# Altium schematic sheet pagerv2.SchDoc
size A4; SheetNumber: 1; SheetTotal: 2
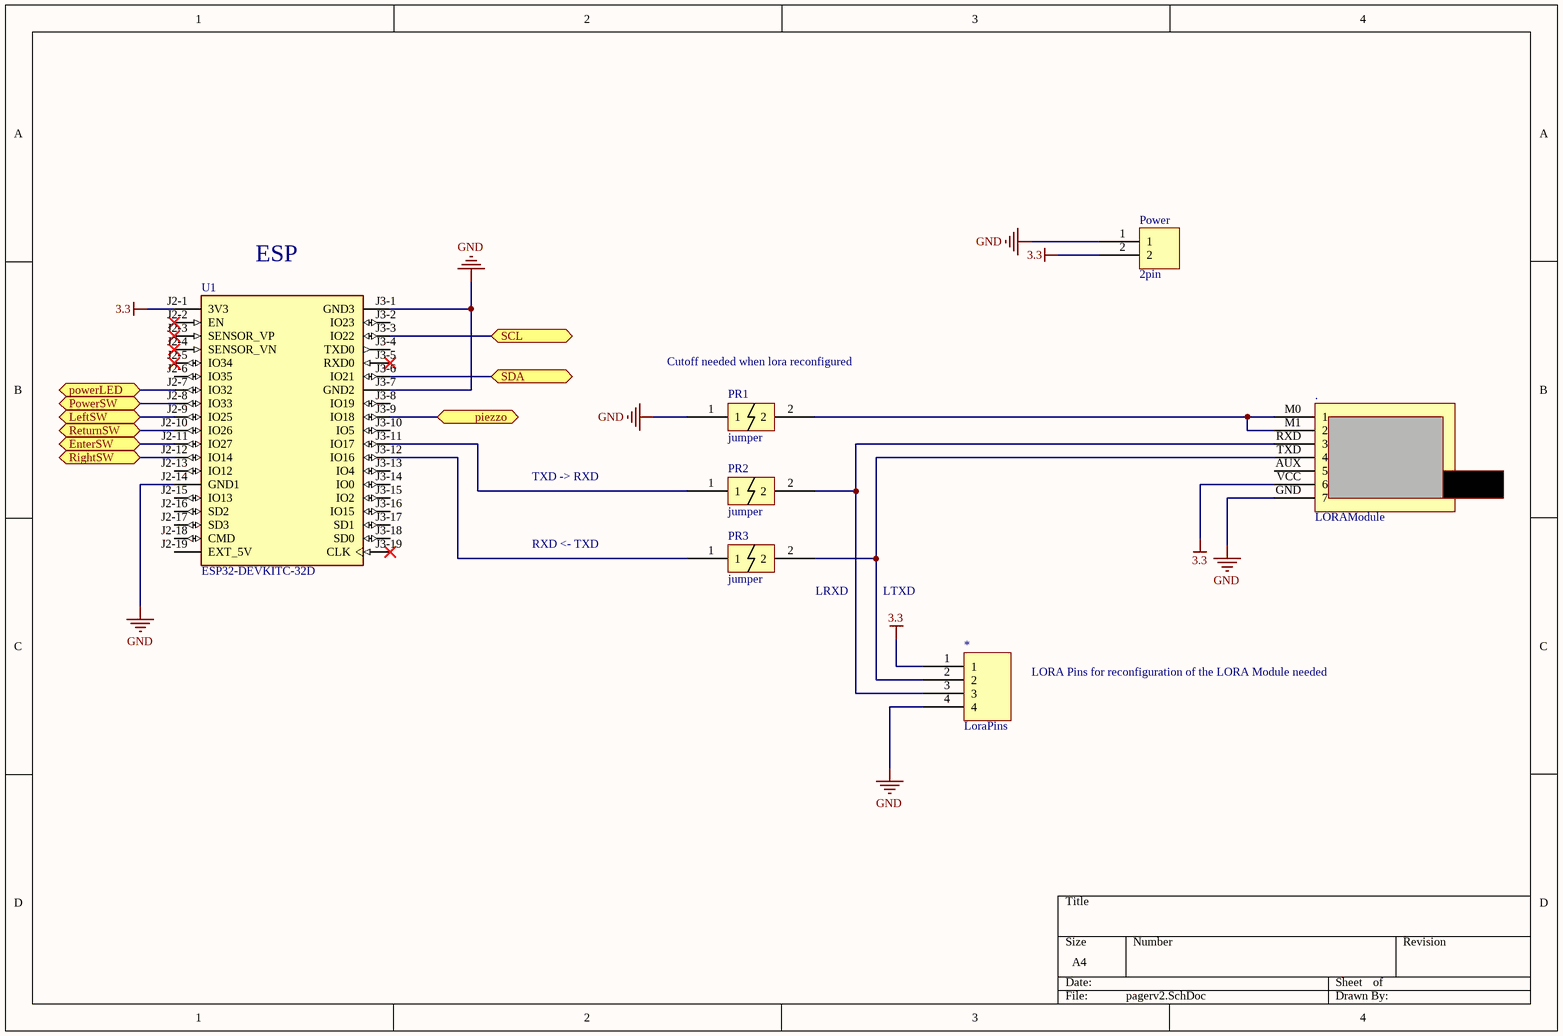
[diagram p0: pagerv2.SchDoc]

## Parts
*  LoraPins  [4pin]
.  LORAModule  [LORAmodule]
Power  2pin  [2PIN]
PR1  jumper  [jumper]
PR2  jumper  [jumper]
PR3  jumper  [jumper]
U1  ESP32-DEVKITC-32D  [MODULE_ESP32-DEVKITC-32D]

## Ports
EnterSW (bidir, see pagerv2IO[1C]), LeftSW (bidir, see pagerv2IO[1B]), piezzo (bidir, see pagerv2IO[4C]), powerLED (bidir, see pagerv2IO[3C]), PowerSW (bidir, see pagerv2IO[1B]), ReturnSW (bidir, see pagerv2IO[1A]), RightSW (bidir, see pagerv2IO[1C]), SCL (bidir, see pagerv2IO[3A], pagerv2IO[3B]), SDA (bidir, see pagerv2IO[3A], pagerv2IO[3B])

## Nets
3.3: *.1 ..VCC(6) Power.2 U1.J2-1(3V3)
GND: *.4 ..GND(7) Power.1 PR1.1 U1.J2-14(GND1) U1.J3-1(GND3) U1.J3-7(GND2)
EnterSW: U1.J2-11(IO27) ; port EnterSW
LeftSW: U1.J2-9(IO25) ; port LeftSW
piezzo: U1.J3-9(IO18) ; port piezzo
powerLED: U1.J2-7(IO32) ; port powerLED
PowerSW: U1.J2-8(IO33) ; port PowerSW
ReturnSW: U1.J2-10(IO26) ; port ReturnSW
RightSW: U1.J2-12(IO14) ; port RightSW
SCL: U1.J3-3(IO22) ; port SCL
SDA: U1.J3-6(IO21) ; port SDA
Net*_2: *.2 ..TXD(4) PR3.2
Net*_3: *.3 ..RXD(3) PR2.2
Net._M0: ..M0(1) ..M1(2) PR1.2
NetPR2_1: PR2.1 U1.J3-11(IO17)
NetPR3_1: PR3.1 U1.J3-12(IO16)

Not connected (* = marked no-connect by the designer): . AUX(5); U1 J2-2(EN)* J2-3(SENSOR_VP)* J2-4(SENSOR_VN)* J2-5(IO34)* J2-6(IO35) J2-13(IO12) J2-15(IO13) J2-16(SD2) J2-17(SD3) J2-18(CMD) J2-19(EXT_5V) J3-2(IO23) J3-4(TXD0) J3-5(RXD0)* J3-8(IO19) J3-10(IO5) J3-13(IO4) J3-14(IO0) J3-15(IO2) J3-16(IO15) J3-17(SD1) J3-18(SD0) J3-19(CLK)*

## Notes on the sheet
- (near U1) ESP
- (near PR1) Cutoff needed when lora reconfigured
- TXD -> RXD
- RXD <- TXD
- (near PR3) LRXD
- LTXD
- LORA Pins for reconfiguration of the LORA Module needed

## Library data of the parts
U1 = CMP-015-000000-1: WiFi Development Tools (802.11) ESP32 General Development Kit, ESP32-WROOM-32D on the board; MF: Espressif Systems; Price: None; Availability: In Stock; SnapEDA_Link: https://www.snapeda.com/parts/ESP32-DEVKITC-32D/Espressif+Systems/view-part/?ref=snap; Value: *; Purchase-URL: https://pricing.snapeda.com/search/part/ESP32-DEVKITC-32D/?ref=eda; Pin Count: 38; Check_prices: https://www.snapeda.com/parts/ESP32-DEVKITC-32D/Espressif+Systems/view-part/?ref=eda; Package: None; MP: ESP32-DEVKITC-32D; Component Type: Standard; Design Item ID: ESP32-DEVKITC-32D; Source: ESP32-DEVKITC-32D.SchLib